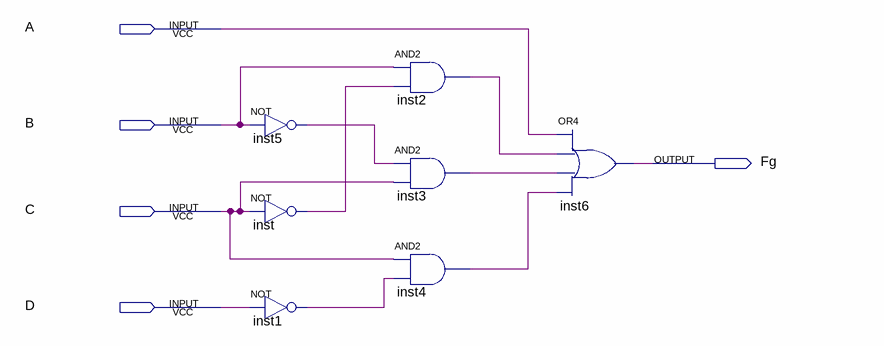
[diagram p0: schematic sheet]
// Quartus schematic Fg.bdf as structural Verilog: 7 symbols, 5 pins
module Fg (
  input  A,
  input  B,
  input  C,
  input  D,
  output Fg
);

  wire inst1_out, inst2_out, inst3_out, inst4_out, inst5_out, inst_out;

  not inst5 (inst5_out, B);
  not inst (inst_out, C);
  not inst1 (inst1_out, D);
  and inst2 (inst2_out, B, inst_out);
  and inst3 (inst3_out, inst5_out, C);
  and inst4 (inst4_out, C, inst1_out);
  or inst6 (Fg, A, inst2_out, inst3_out, inst4_out);
endmodule
